# EAGLE schematic diode (EAGLE 8.4.0)
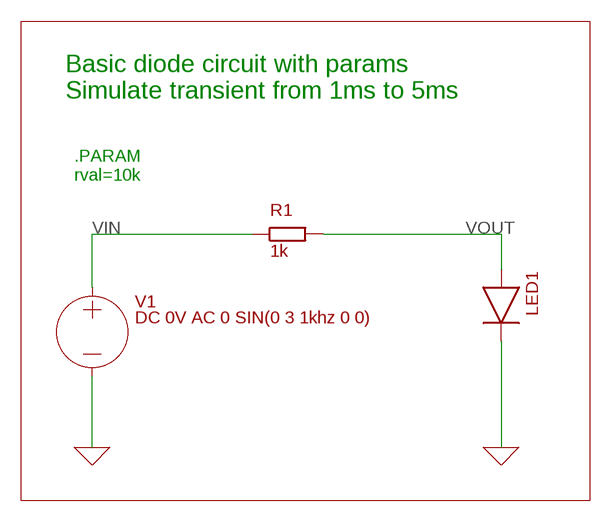
[diagram p0: schematic, sheet 1]

## Parts
LED1  DIODE  (no package)
R1  1k  R  (no package)
V1  DC 0V AC 0 SIN(0 3 1khz 0 0)  VOLTAGE  (no package)

## Nets
0: LED1.C V1.- ; supply symbol labelled GND
VIN: R1.1 V1.+
VOUT: LED1.A R1.2

## Notes on the sheet
- Basic diode circuit with params
  Simulate transient from 1ms to 5ms
- .PARAM
  rval=10k

## Library data of the parts
LED1 = ngspice-simulation:DIODE: Diode
R1 = ngspice-simulation:R: RESISTOR
V1 = ngspice-simulation:VOLTAGE: Independent Voltage Source, either DC, AC, PULSE, SINE, PWL, EXP, or SFFM; VALUE: 0V